# EAGLE design wifi board (EAGLE 7.6.0)
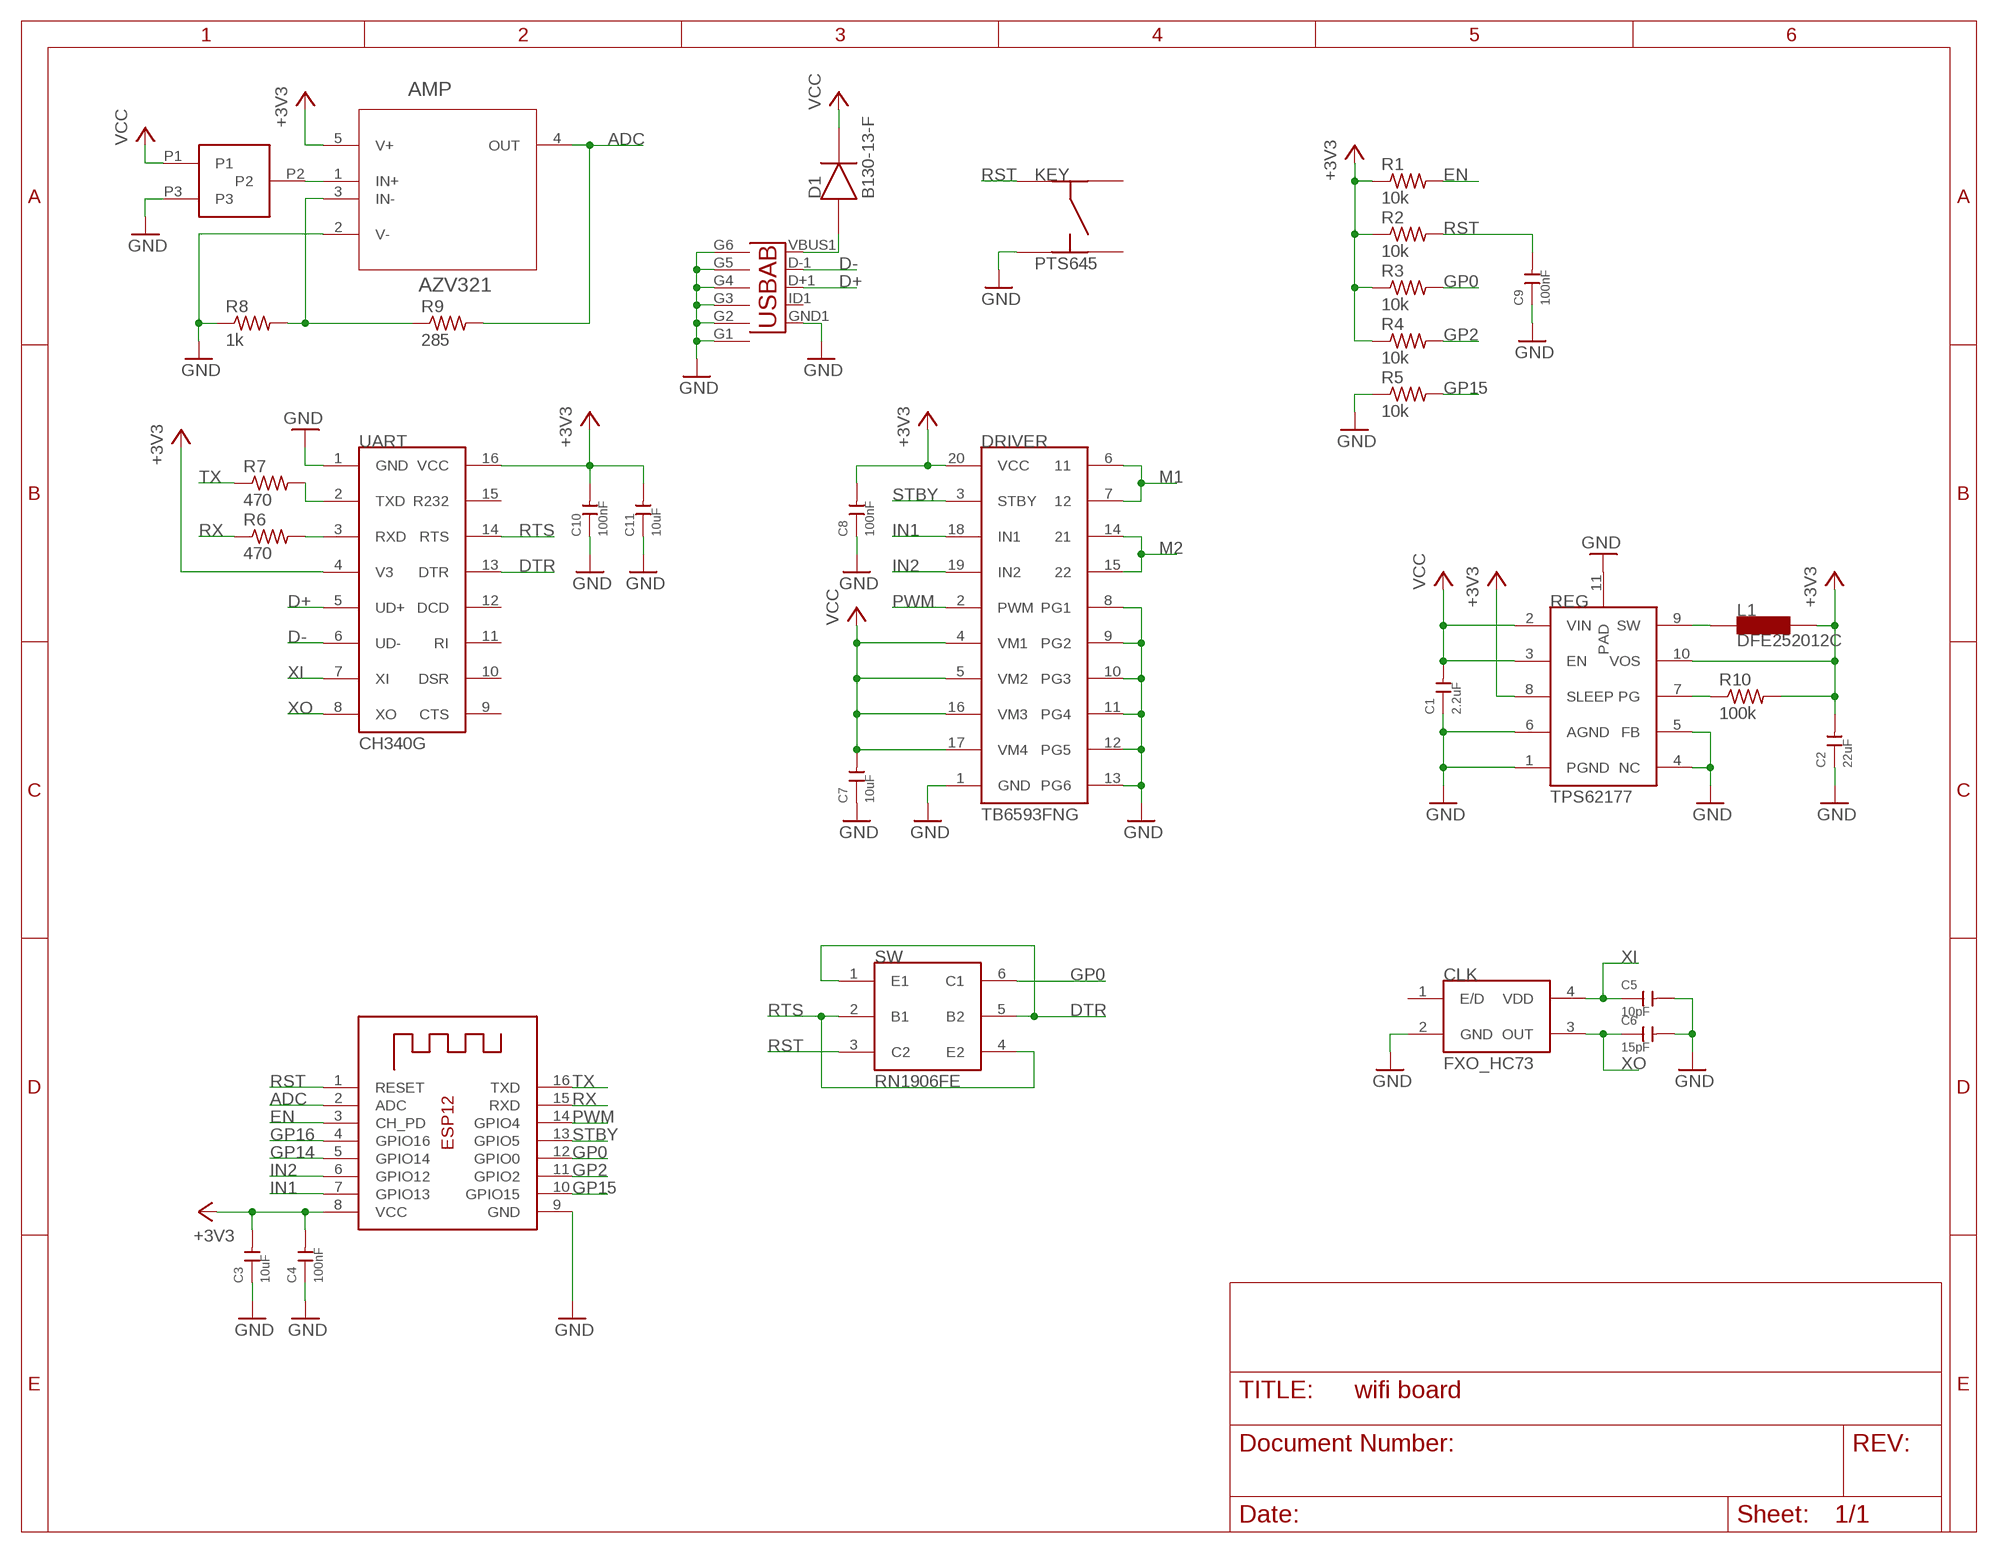
[diagram p0: schematic, sheet 1]

## Parts
AMP  AZV321  LMV321SEG-7  [SOT65P210X110-5N]
C1  2.2uF  CERAMIC-0.5PF-50V-0.1PF-NPO(0603)  [C0603]
C2  22uF  CERAMIC-0.5PF-50V-0.1PF-NPO(0603)  [C0603]
C3  10uF  CERAMIC-0.5PF-50V-0.1PF-NPO(0603)  [C0603]
C4  100nF  CERAMIC-0.5PF-50V-0.1PF-NPO(0603)  [C0603]
C5  10pF  CERAMIC-0.5PF-50V-0.1PF-NPO(0603)  [C0603]
C6  15pF  CERAMIC-0.5PF-50V-0.1PF-NPO(0603)  [C0603]
C7  10uF  CERAMIC-0.5PF-50V-0.1PF-NPO(0603)  [C0603]
C8  100nF  CERAMIC-0.5PF-50V-0.1PF-NPO(0603)  [C0603]
C9  100nF  CERAMIC-1PF-50V-0.25PF-NPO(0603)  [C0603]
C10  100nF  CERAMIC-0.5PF-50V-0.1PF-NPO(0603)  [C0603]
C11  10uF  CERAMIC-0.5PF-50V-0.1PF-NPO(0603)  [C0603]
CLK  FXO_HC73  [4-SMD]
CONN  AVX_CONN  [AVX_CONN]
D1  B130-13-F  [SMA]
DRIVER  TB6593FNG  [SSOP-20]
ESP12  ESP-12  [ESP-12]
KEY  PTS645  BUTTON  [BUTTON]
L1  DFE252012C  [1008]
R1  10k  R-US_R0603  [R0603]
R2  10k  R-US_R0603  [R0603]
R3  10k  R-US_R0603  [R0603]
R4  10k  R-US_R0603  [R0603]
R5  10k  R-US_R0603  [R0603]
R6  470  R-US_R0603  [R0603]
R7  470  R-US_R0603  [R0603]
R8  1k  R-US_R0603  [R0603]
R9  285  R-US_R0603  [R0603]
R10  100k  R-US_R0603  [R0603]
REG  TPS62177  [WSON-10]
SW  RN1906FE  [SOT-563]
UART  CH340G  [20-16]
USB  USB""  [USB-MICRO-SMD]

## Nets
+3V3: AMP.5(V+) C2.2 C3.2 C4.2 C8.2 C10.2 C11.2 DRIVER.20(VCC) ESP12.8(VCC) L1.P$3 R1.1 R2.1 R3.1 R4.1 R10.2 REG.8(SLEEP) REG.10(VOS) UART.4(V3) UART.16(VCC)
ADC: AMP.4(OUT) ESP12.2(ADC) R9.2
D+: UART.5(UD+) USB.D+1(D+)
D-: UART.6(UD-) USB.D-1(D-)
DTR: SW.1(E1) SW.5(B2) UART.13(DTR)
EN: ESP12.3(CH_PD) R1.2
GND: AMP.2(V-) C1.1 C2.1 C3.1 C4.1 C5.2 C6.2 C7.1 C8.1 C9.1 C10.1 C11.1 CLK.2(GND) CONN.P3 DRIVER.1(GND) DRIVER.8(PG1) DRIVER.9(PG2) DRIVER.10(PG3) DRIVER.11(PG4) DRIVER.12(PG5) DRIVER.13(PG6) ESP12.9(GND) KEY.3 R5.1 R8.1 REG.1(PGND) REG.4(NC) REG.5(FB) REG.6(AGND) REG.11(PAD) UART.1(GND) USB.G1 USB.G2 USB.G3 USB.G4 USB.G5 USB.G6 USB.GND1(GND)
GP0: ESP12.12(GPIO0) R3.2 SW.6(C1)
GP2: ESP12.11(GPIO2) R4.2
GP14: ESP12.5(GPIO14)
GP15: ESP12.10(GPIO15) R5.2
GP16: ESP12.4(GPIO16)
IN1: DRIVER.18(IN1) ESP12.7(GPIO13)
IN2: DRIVER.19(IN2) ESP12.6(GPIO12)
M1: DRIVER.6 DRIVER.7
M2: DRIVER.14 DRIVER.15
N$1: R7.2 UART.2(TXD)
N$2: R10.1 REG.7(PG)
N$3: D1.AN USB.VBUS1(VBUS)
N$5: AMP.1(IN+) CONN.P2
N$6: AMP.3(IN-) R8.2 R9.1
N$7: R6.2 UART.3(RXD)
PWM: DRIVER.2(PWM) ESP12.14(GPIO4)
RST: C9.2 ESP12.1(RESET) KEY.1 R2.2 SW.3(C2)
RTS: SW.2(B1) SW.4(E2) UART.14(RTS)
RX: ESP12.15(RXD) R6.1
STBY: DRIVER.3(STBY) ESP12.13(GPIO5)
SW: L1.P$2 REG.9(SW)
TX: ESP12.16(TXD) R7.1
VCC: C1.2 C7.2 CONN.P1 D1.CATH DRIVER.4(VM1) DRIVER.5(VM2) DRIVER.16(VM3) DRIVER.17(VM4) REG.2(VIN) REG.3(EN)
XI: C5.1 CLK.4(VDD) UART.7(XI)
XO: C6.1 CLK.3(OUT) UART.8(XO)
Unconnected: CLK.1(E/D) KEY.2 KEY.4 UART.9(CTS) UART.10(DSR) UART.11(RI) UART.12(DCD) UART.15(R232) USB.ID1(USBID)

## Library data of the parts
AMP = Diodes_Inc_By_element14_Batch_1:LMV321SEG-7: OPERATIONAL AMPLIFIERS; MPN: LMV321SEG-7; OC_FARNELL: 1904046; OC_NEWARK: 55T3175; PACKAGE: SOT353-5; SUPPLIER: DIODES INC.
C1-C8 C10 C11 = Seeed-OPL-Capacitor:CERAMIC-0.5PF-50V-0.1PF-NPO(0603): 302010115; VALUE: 0.5PF 50V
C9 = Seeed-OPL-Capacitor:CERAMIC-1PF-50V-0.25PF-NPO(0603): 302010096; VALUE: 1PF 50V 00.25PF
CLK = CUSTOM:FXO_HC73
CONN = CUSTOM:AVX_CONN
D1 = CUSTOM:B130-13-F
DRIVER = CUSTOM:TB6593FNG
ESP12 = adafruit:ESP-12
KEY = CUSTOM:BUTTON
L1 = CUSTOM:DFE252012C
R1-R10 = resistor:R-US_: RESISTOR, American symbol
REG = CUSTOM:TPS62177
SW = CUSTOM:RN1906FE
UART = CUSTOM:CH340G
USB = MicroUSB:USB: This is a USB AB connector that is compatible with USB OTG. i.e. this connector can serve as a host or device

## Board
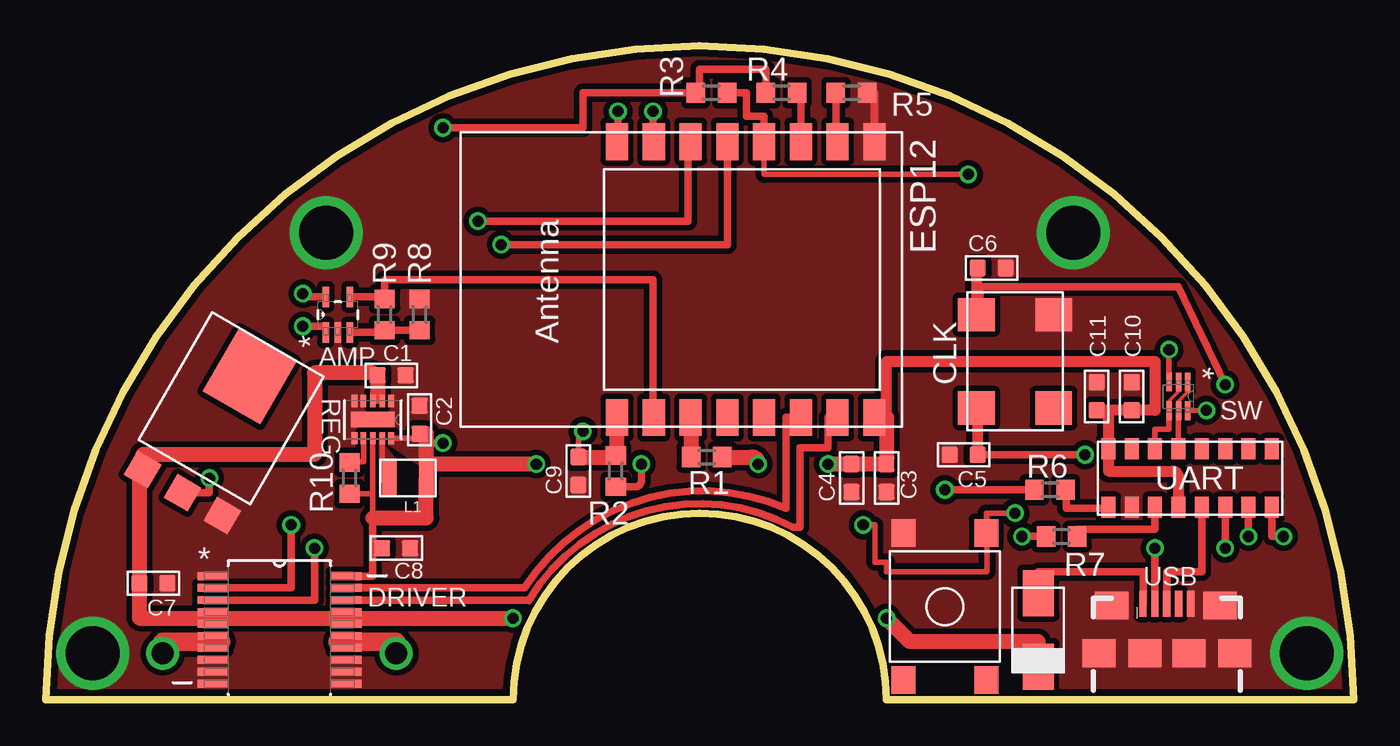
[diagram p1: board, top side]
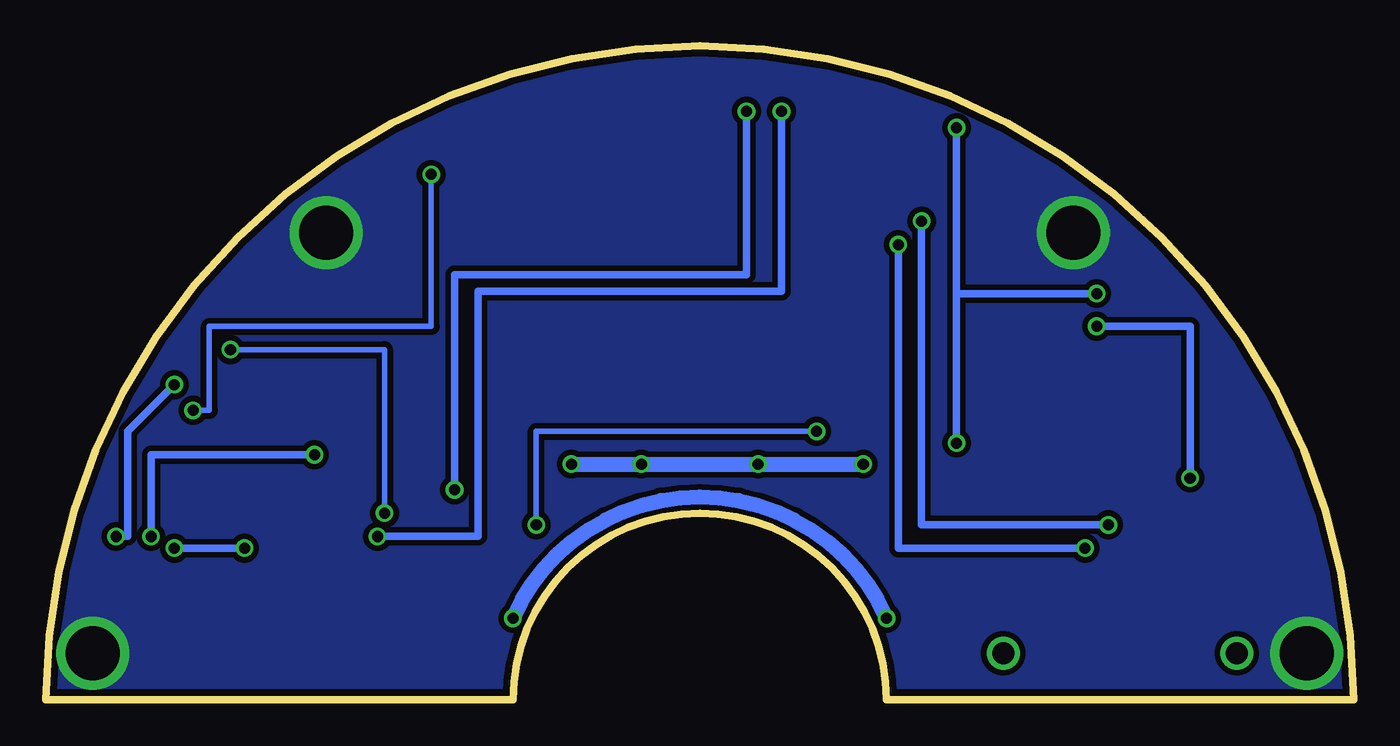
[diagram p2: board, bottom side, seen from below]

Size 71.12 x 35.56 mm. Coordinates in mm from the lower left corner, seen from the top.
Outline: 0,0 25.4,0 arc-180 45.72,0 71.12,0 arc180 0,0
Copper layers (1*16): Top 0.0356mm / dielectric 1.5011mm / Bottom 0.0356mm
Design rules "LaenPCBOrder": minimum track width 6mil, minimum drill 13mil, track to track 6mil, track to pad 6mil, pad to pad 6mil, via to via 6mil, smd to smd 6mil, copper to edge 15mil, drill to drill 6mil, minimum pad ring 7mil, minimum via ring 7mil, stop-mask expansion 3mil, vias tented up to drill 0mil, thermal gap 10mil

### Footprints (pad centres in the part's own frame; a part is rotated, then mirrored left to right if it is on the bottom)
SOT65P210X110-5N = smd 1.118 x 0.356: 1 -0.965,0.66; 2 -0.965,0; 3 -0.965,-0.66; 4 0.965,-0.66; 5 0.965,0.66
C0603 = smd 0.889 x 0.889: 1 0,0.762; 2 0,-0.762
4-SMD = smd 1.8 x 2: 1 -2.54,-2.1; 2 2.54,-2.1; 3 2.54,2.1; 4 -2.54,2.1
AVX_CONN = smd 1.5 x 1.5: P1 -2.5,-4.3; P2 0,-4.3; P3 2.5,-4.3 | smd 3.6 x 3.95: P$2 0,3
SMA = smd 2.5 x 1.7: AN 2,0; CATH -2,0
SSOP-20 = smd 1.651 x 0.432: 1 -3.632,2.921; 2 -3.632,2.286; 3 -3.632,1.626; 4 -3.632,0.965; 5 -3.632,0.33; 6 -3.632,-0.33; 7 -3.632,-0.965; 8 -3.632,-1.626; 9 -3.632,-2.286; 10 -3.632,-2.921; 11 3.632,-2.921; 12 3.632,-2.286; 13 3.632,-1.626; 14 3.632,-0.965; 15 3.632,-0.33; 16 3.632,0.33; 17 3.632,0.965; 18 3.632,1.626; 19 3.632,2.286; 20 3.632,2.921
ESP-12 = smd 2 x 1.2: 1 -7.5,4.5; 2 -7.5,2.5; 3 -7.5,0.5; 4 -7.5,-1.5; 5 -7.5,-3.5; 6 -7.5,-5.5; 7 -7.5,-7.5; 8 -7.5,-9.5; 9 7.5,-9.5; 10 7.5,-7.5; 11 7.5,-5.5; 12 7.5,-3.5; 13 7.5,-1.5; 14 7.5,0.5; 15 7.5,2.5; 16 7.5,4.5
BUTTON = smd 1.5 x 1.3: 1 -4,2.25; 2 4,2.25; 3 -4,-2.25; 4 4,-2.25
1008 = smd 0.8 x 2: P$2 1,0; P$3 -1,0
R0603 = smd 1 x 1.1: 1 -0.85,0; 2 0.85,0
WSON-10 = smd 0.66 x 0.305: 1 -1.016,0.991; 2 -1.016,0.508; 3 -1.016,0; 4 -1.016,-0.508; 5 -1.016,-0.991; 6 1.016,-0.991; 7 1.016,-0.508; 8 1.016,0; 9 1.016,0.508; 10 1.016,0.991 | smd 0.838 x 2.388: 11 0,0
SOT-563 = smd 1.016 x 0.305: 1 -0.787,0.508; 2 -0.787,0; 3 -0.787,-0.508; 4 0.787,-0.508; 5 0.787,0; 6 0.787,0.508
20-16 = smd 0.762 x 1.143: 1 -3.175,-1.587; 2 -1.905,-1.587; 3 -4.445,-1.587; 4 -0.635,-1.587; 5 0.635,-1.587; 6 1.905,-1.587; 7 3.175,-1.587; 8 4.445,-1.587; 9 4.445,1.587; 10 3.175,1.587; 11 1.905,1.587; 12 0.635,1.587; 13 -0.635,1.587; 14 -1.905,1.587; 15 -3.175,1.587; 16 -4.445,1.587
USB-MICRO-SMD = smd 1.4 x 0.4: D+1 2.7,0; D-1 2.7,0.65; GND1 2.7,-1.3; ID1 2.7,-0.65; VBUS1 2.7,1.3 | smd 1.5 x 1.8: G1 0,3.7; G2 0,1.2; G3 0,-1.2; G4 0,-3.7; G5 2.6,3; G6 2.6,-2.9

### Placement (x,y rotation side)
AMP  15.87,20.95 90 top
C1  18.8,17.65 270 top
C2  20.32,15.24 0 top
C3  45.72,12.06 180 top
C4  43.81,12.06 180 top
C5  49.91,13.34 270 top
C6  51.43,23.5 90 top
C7  5.84,6.35 270 top
C8  19.05,8.26 270 top
C9  28.96,12.45 180 top
C10  59.05,16.51 0 top
C11  57.15,16.51 0 top
CLK  52.7,18.41 90 top
CONN  9.58,15 330 top
D1  53.98,3.81 90 top
DRIVER  12.7,3.81 0 top
ESP12  35.56,22.86 90 top
KEY  48.9,5.08 270 top
L1  19.68,12.06 180 top
R1  35.94,13.21 180 top
R2  30.99,12.45 90 top
R3  36.2,33.02 0 top
R4  40,33.02 0 top
R5  43.81,33.02 180 top
R6  54.61,11.43 0 top
R7  55.24,8.89 0 top
R8  20.32,20.95 270 top
R9  18.41,20.95 90 top
R10  16.51,12.06 270 top
REG  17.78,15.24 270 top
SW  61.59,16.51 270 top
UART  62.23,12.06 0 top
USB  60.96,2.54 90 top

### Tracks (layer width: path | path; a pad name or v marks a point on that pad's centre or on a via)
+3V3  (via drill 0.6)
  Top 0.305: REG.8 17.78,11.21 | 17.78,11.21 17.78,9.91 | R10.2 17.78,11.21 | 20.68,14.48 C2.2 20.32,14.22 REG.10
  Top 0.406: 17.78,9.91 17.78,8.26 | 17.78,8.26 17.78,6.73 DRIVER.20 | AMP.5 13.97,21.92 v13.97,22.1 | v21.59,13.97 20.68,13.97 | v21.59,31.11 29.21,31.11 29.21,33.02 R3.1 35.56,33.02 35.56,34.29 39.16,34.29 R4.1 | C8.2 17.78,8.26 | R2.1 32.07,11.6 arc90 32.38,11.91 v32.38,12.83
  Top 0.61: 45.72,15.36 45.72,18.41 60.32,18.41 60.32,15.75 C10.2 C11.2 57.79,15.75 UART.16 57.79,12.45 61.28,12.45 arc-90 61.59,12.13 UART.4
  Top 0.813: ESP12.8 45.72,15.36 C3.2 C4.2 v42.54,12.83 | 17.78,9.91 20.68,9.91 L1.P$3 | 20.68,14.48 20.68,13.97 L1.P$3 | v26.67,12.83 21,12.83 arc90 20.68,12.51 L1.P$3 | R1.1 38.42,13.21 arc-90 38.73,12.89 v38.73,12.83
  Bottom 0.406: v13.97,22.1 21.59,22.1 | 21.59,22.1 v21.59,13.97 | 21.59,22.1 v21.59,31.11
  Bottom 0.813: v42.54,12.83 v38.73,12.83 v32.38,12.83 v26.67,12.83
  pour Top (no thermals): 18.62,13.89 20.88,12.4 20.88,14.35 18.62,14.35
ADC
  Top 0.305: 18.41,21.92 R9.2 | ESP12.2 33.02,15.36
  Top 0.406: AMP.4 18.41,21.92 | 33.02,15.36 33.02,22.86 18.41,22.86 R9.2
D+
  Top 0.406: USB.D+1 60.96,6.99 62.87,6.99 UART.5
D-  (via drill 0.6)
  Top 0.406: USB.D-1 60.32,5.24 v60.32,8.26 | v64.14,8.26 UART.6
  Bottom 0.406: v60.32,8.26 v64.14,8.26
DTR
  Top 0.203: SW.1 62.1,16.76 61.59,16.26 SW.5
  Top 0.305: SW.5 UART.13
EN
  Top 0.61: ESP12.3 35.09,15.36
  Top 0.813: 35.09,15.36 R1.2
GND  (via drill 2.95)
  Top 0.305: R5.1 45.06,33.02
  Top 0.406: 45.06,33.02 ESP12.9
  other vias: 2.54,2.54 15.24,25.4 55.88,25.4 68.58,2.54
  pour Top (isolate 0.305, no thermals): 0,0 25.4,0 arc-180 45.72,0 71.12,0 arc180
  pour Bottom (isolate 0.305): 0,0 25.4,0 arc-180 45.72,0 71.12,0 arc180
GP0  (via drill 0.6)
  Top 0.305: SW.6 v63.12,15.75 | v50.16,28.57 39.06,28.57 ESP12.12
  Top 0.406: R3.2 38.1,33.02 38.1,31.75 39.06,31.75 ESP12.12
  Bottom 0.305: v63.12,15.75 62.23,15.75 62.23,20.32 50.16,20.32 v50.16,28.57
GP2
  Top 0.305: R4.2 41.06,33.02
  Top 0.406: 41.06,33.02 ESP12.11
GP15
  Top 0.406: ESP12.10 42.96,30.36 R5.2
IN1
  Top 0.305: 26.29,5.44 26.29,5.33 | ESP12.7 42.54,15.36
  Top 0.406: DRIVER.18 26.29,5.44 arc-87 40.64,9.4 41.02,9.4 41.02,13.72 42.54,13.72 42.54,15.36
IN2
  Top 0.305: 26.03,6.1 26.03,6.22
  Top 0.406: ESP12.6 40.26,15.36 40.26,10.41 arc81 26.03,6.1 DRIVER.19
M1  (via drill 1.2)
  Top 0.305: DRIVER.7 DRIVER.6 arc90 9.37,3.17 9.53,3.17
  Top 1.016: v6.35,2.54 6.35,3.17 9.53,3.17
M2  (via drill 1.2)
  Top 0.305: 15.87,3.17 16.03,3.17 arc90 DRIVER.15 DRIVER.14
  Top 1.016: v19.05,2.54 19.05,3.17 15.87,3.17
N$1
  Top 0.406: UART.2 60.32,9.27 56.09,9.27 R7.2
N$2
  Top 0.305: REG.7 17.27,12.95 16.51,12.95 R10.1
N$3
  Top 0.406: USB.VBUS1 59.69,5.24 59.69,6.99 53.98,6.99 D1.AN
N$5  (via drill 0.6)
  Top 0.305: 15.21,20.32 AMP.1
  Top 0.406: CONN.P2 8.89,11.28 v8.89,12.06 | v13.97,20.32 15.21,20.32
  Bottom 0.406: v8.89,12.06 8.89,20.32 v13.97,20.32
N$6
  Top 0.305: 18.41,19.99 R9.1
  Top 0.406: AMP.3 18.41,19.99 | R9.1 R8.2
N$7
  Top 0.406: R6.2 55.5,11.43 55.5,10.41 57.79,10.41 UART.3
PWM  (via drill 0.6)
  Top 0.406: ESP12.14 34.92,30.36 34.92,26.04 v23.49,26.04 | v13.33,9.53 13.33,6.1 DRIVER.2
  Bottom 0.406: v23.49,26.04 23.49,9.53 v13.33,9.53
RST  (via drill 0.6)
  Top 0.305: SW.3 v61.09,19.05 | v52.7,10.16 51.18,10.16 | KEY.1 51.15,10.16 51.18,10.16 | 51.18,10.16 51.18,6.99 45.72,6.99 45.72,7.49 45.09,7.49 45.09,9.53 v44.45,9.53 | v29.21,14.61 28.96,14.61 C9.2
  Top 0.813: ESP12.1 31.06,13.55 R2.2 30.86,13.21 C9.2
  Bottom 0.305: v61.09,19.05 52.7,19.05 v52.7,10.16 | v44.45,9.53 44.45,14.61 v29.21,14.61
RTS
  Top 0.203: SW.2 61.59,16.76 61.09,16.26 SW.4
  Top 0.305: SW.4 61.09,14.73 60.32,14.73 UART.14
RX  (via drill 0.6)
  Top 0.406: ESP12.15 33.02,30.36 v33.02,32 | v48.9,11.43 R6.1
  Bottom 0.406: v33.02,32 33.02,23.11 48.9,23.11 v48.9,11.43
STBY  (via drill 0.6)
  Top 0.406: DRIVER.3 14.6,5.44 v14.6,8.26 | v24.77,24.77 37.06,24.77 ESP12.13
  Bottom 0.406: v14.6,8.26 24.77,8.26 v24.77,24.77
SW
  Top 0.305: REG.9 18.29,11.94 18.68,11.94 L1.P$2
  pour Top (no thermals): 18.41,14.48 18.41,13.84 19.05,13.08 19.05,11.05 18.16,11.05 18.16,14.48
TX  (via drill 0.6)
  Top 0.406: ESP12.16 31.11,30.36 v31.11,32 | v53.09,8.89 R7.1
  Bottom 0.406: v31.11,32 31.11,22.23 47.62,22.23 47.62,8.89 v53.09,8.89
VCC  (via drill 0.6)
  Top 0.305: 17.82,17.74 17.78,17.78 | DRIVER.4 DRIVER.5 arc-90 8.89,4.32 8.89,4.45 | 18.03,16.64 arc-90 18.29,16.38 REG.2 REG.3 | DRIVER.17 DRIVER.16 16.33,4.45 16.51,4.45
  Top 0.813: D1.CATH 53.98,3.17 46.99,3.17 v45.72,4.45 | 17.78,17.78 14.6,17.78 14.6,13.34 5.26,13.34 CONN.P1 5.08,12.53 C7.2 5.08,4.45 8.89,4.45 16.51,4.45 v25.4,4.45 | 17.82,17.74 arc45 C1.2 18.03,16.64
  Bottom 0.813: v45.72,4.45 arc132 v25.4,4.45
XI  (via drill 0.6)
  Top 0.406: C5.1 v56.51,13.34 | v65.41,8.89 UART.7
  Top 0.61: CLK.4 50.67,15.88 C5.1
  Bottom 0.406: v56.51,13.34 65.41,13.34 v65.41,8.89
XO  (via drill 0.6)
  Top 0.406: CLK.3 50.8,20.95 50.8,22.48 61.59,22.48 v64.14,17.14 | v67.31,8.89 66.68,8.89 UART.8
  Top 0.61: C6.1 arc90 50.6,23.43 CLK.3
  Bottom 0.406: v67.31,8.89 66.68,8.89 66.68,14.61 v64.14,17.14